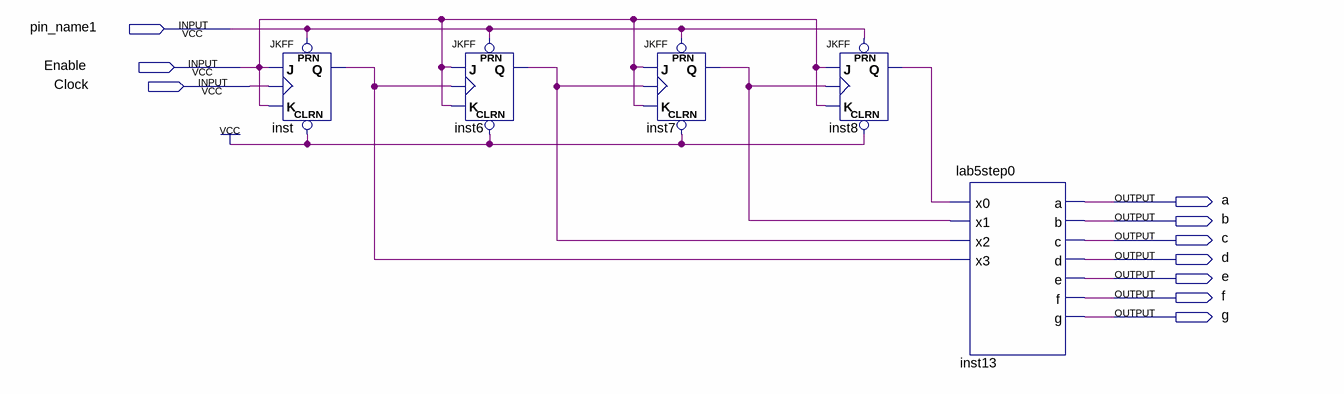
[diagram p0: schematic sheet]
// Quartus schematic lab10step3b.bdf as structural Verilog: 5 symbols, 10 pins
module lab10step3b (
  input  pin_name1,
  input  Enable,
  input  Clock,
  output a,
  output b,
  output c,
  output d,
  output e,
  output f,
  output g
);

  wire inst6_q, inst7_q, inst8_q, inst_q;

  JKFF inst (.PRN(pin_name1), .CLRN(1'b1), .K(Enable), .J(Enable), .CLK(Clock), .Q(inst_q));
  JKFF inst6 (.PRN(pin_name1), .CLRN(1'b1), .K(Enable), .J(Enable), .CLK(inst_q), .Q(inst6_q));
  JKFF inst7 (.PRN(pin_name1), .CLRN(1'b1), .K(Enable), .J(Enable), .CLK(inst6_q), .Q(inst7_q));
  JKFF inst8 (.PRN(pin_name1), .CLRN(1'b1), .K(Enable), .J(Enable), .CLK(inst7_q), .Q(inst8_q));
  lab5step0 inst13 (
    .x0(inst8_q), .x1(inst7_q), .x2(inst6_q), .x3(inst_q), .a(a), .b(b), .c(c), .d(d), .e(e), .f(f), .g(g));
endmodule
